# EAGLE design Ethernet Phy 4 esp32 (EAGLE 9.1.3)
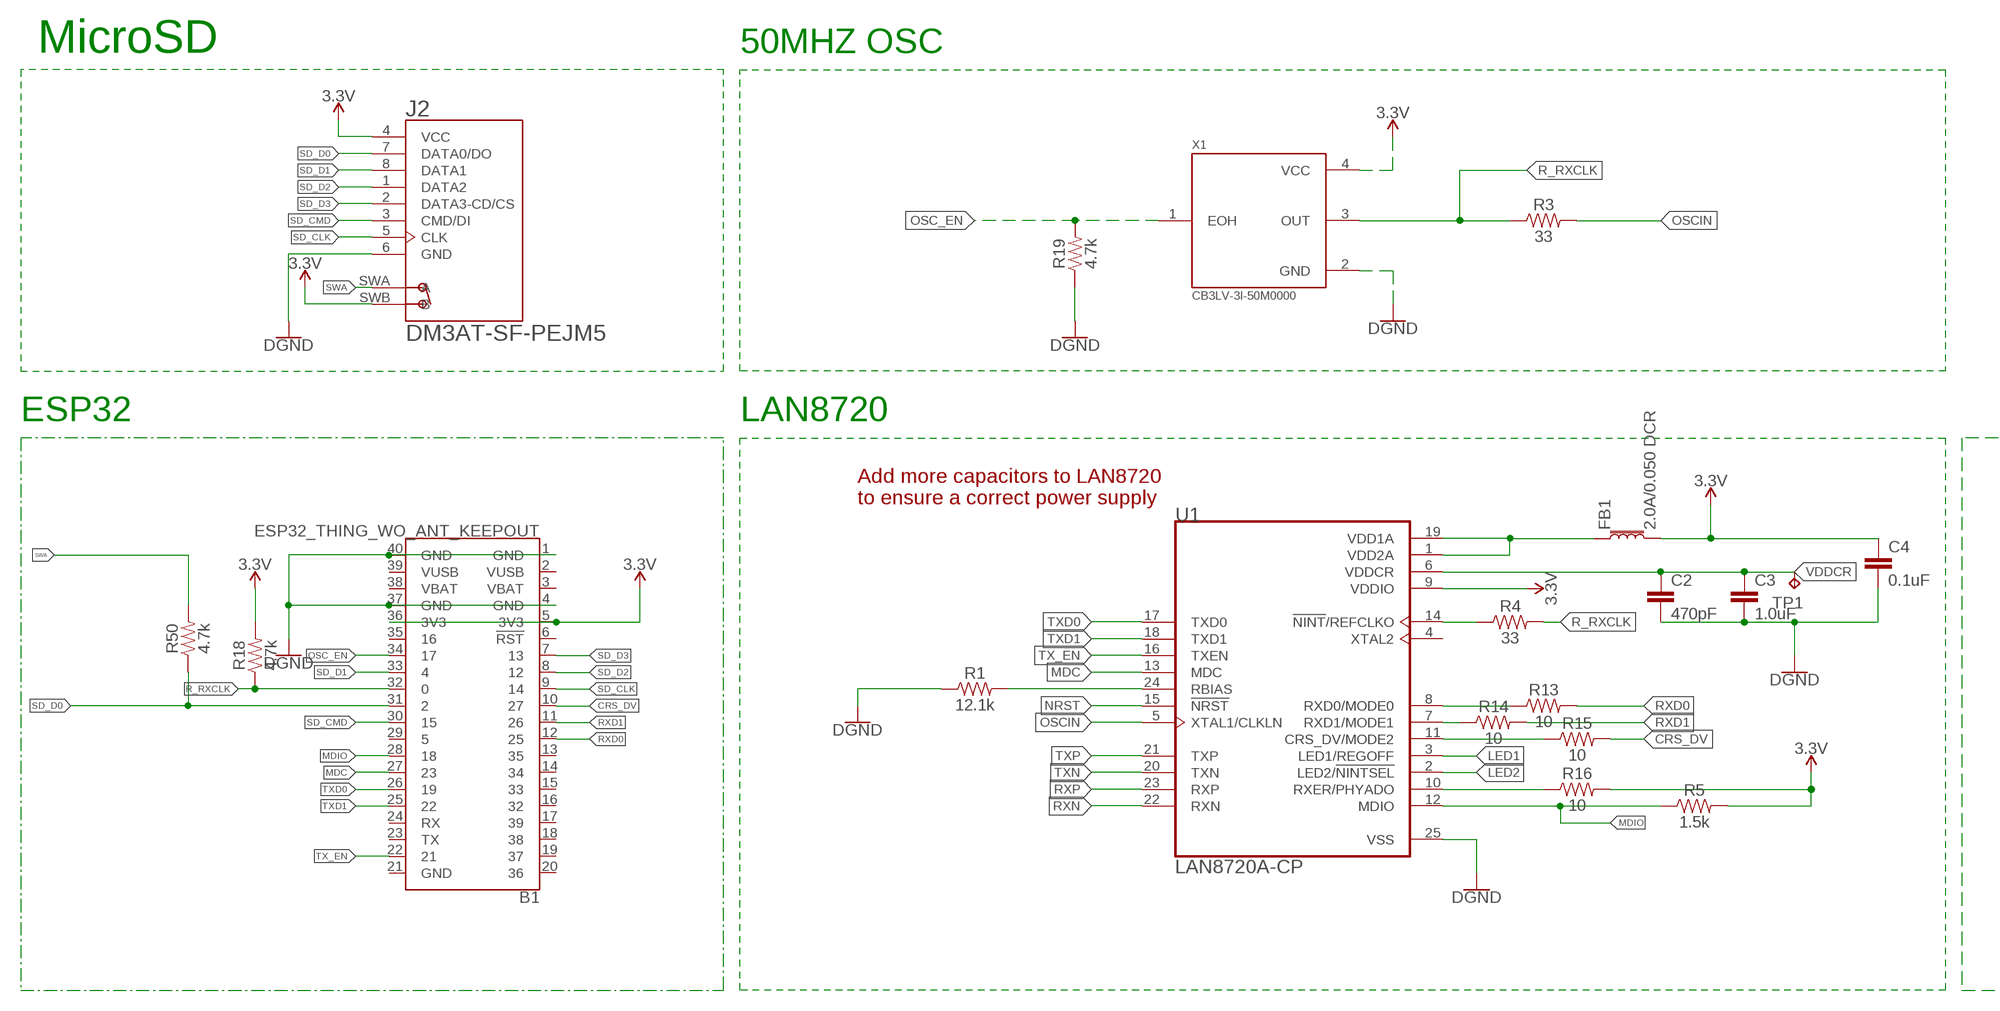
[diagram p0: schematic, sheet 1, part 1 of 2]
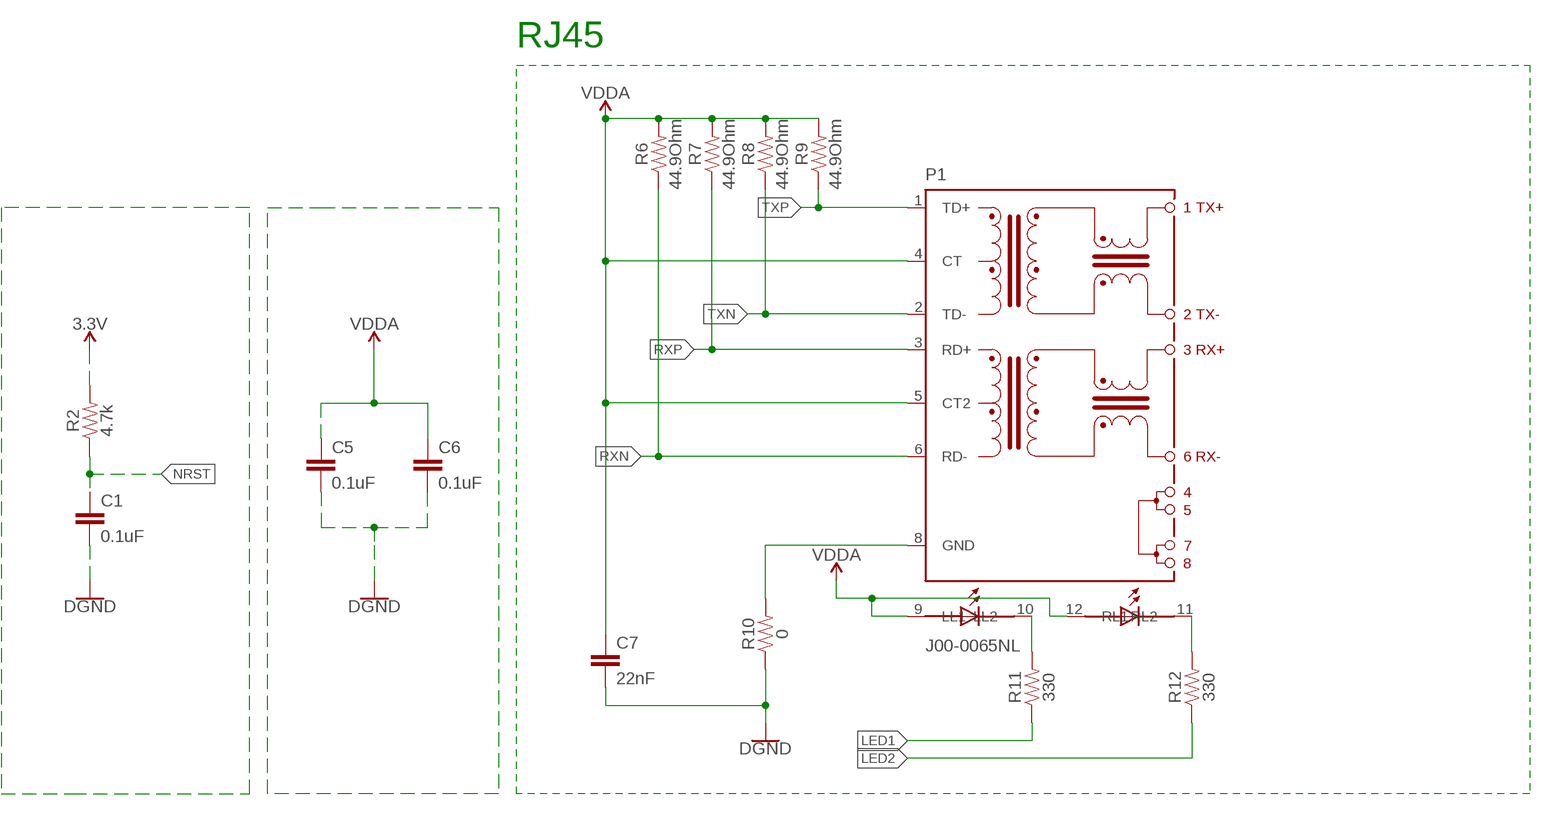
[diagram p1: schematic, sheet 1, part 2 of 2]

## Parts
B1  ESP32_THING_WO_ANT_KEEPOUT  [ESP32_THING_NO_ANT]
C1  0.1uF  0.1UF-0603-100V-10%  [0603]
C2  470pF  470PF-0603-50V-5%  [0603]
C3  1.0uF  1.0UF-0603-16V-10%  [0603]
C4  0.1uF  0.1UF-0603-100V-10%  [0603]
C5  0.1uF  0.1UF-0603-25V-(+80/-20%)  [0603]
C6  0.1uF  0.1UF-0603-25V-(+80/-20%)  [0603]
C7  22nF  22NF/22,000PF-0603-50V-10%  [0603]
FB1  2.0A/0.050 DCR  FERRITE_BEAD-0603  [0603]
J2  DM3AT-SF-PEJM5  [HRS_DM3AT-SF-PEJM5]
P1  J00-0065NL  [PULSE_J00-0065NL]
R1  12.1k  12.1KOHM-0603-1/10W-1%  [0603]
R2  4.7k  4.7KOHM-0603-1/10W-1%  [0603]
R3  33  33OHM-0603-1/10W-1%  [0603]
R4  33  33OHM-0603-1/10W-1%  [0603]
R5  1.5k  1.5KOHM-0603-1/10W-1%  [0603]
R6  44.9Ohm  43KOHM-0603-1/10W-1%  [0603]
R7  44.9Ohm  43KOHM-0603-1/10W-1%  [0603]
R8  44.9Ohm  43KOHM-0603-1/10W-1%  [0603]
R9  44.9Ohm  43KOHM-0603-1/10W-1%  [0603]
R10  0  0OHM-0603-1/10W-5%  [0603]
R11  330  330OHM-0603-1/10W-1%  [0603]
R12  330  330OHM-0603-1/10W-1%  [0603]
R13  10  10OHM-0603-1/10W-1%  [0603]
R14  10  10OHM-0603-1/10W-1%  [0603]
R15  10  10OHM-0603-1/10W-1%  [0603]
R16  10  10OHM-0603-1/10W-1%  [0603]
R18  4.7k  4.7KOHM-0603-1/10W-1%  [0603]
R19  4.7k  4.7KOHM-0603-1/10W-1%  [0603]
R50  4.7k  4.7KOHM-0603-1/10W-1%  [0603]
TP1  TPB1,27  [B1,27]
U1  LAN8720A-CP  [QFN50P400X400X100-25N]
X1  CB3LV-3I-50M0000  [OSCCC700X500X180-4N]

## Nets
3.3V: B1.5(3V3) B1.36(3V3) C4.1 FB1.2 J2.4(VCC) J2.SWB(B) R2.2 R5.2 R16.2 R18.2 U1.9(VDDIO) X1.4(VCC)
CRS_DV: B1.10 R15.2
GND: B1.1(GND) B1.4(GND) B1.37(GND) B1.40(GND) C1.2 C2.2 C3.2 C4.2 C5.2 C6.2 C7.2 J2.6(GND) R1.1 R10.1 R19.1 U1.25(VSS) X1.2(GND) ; supply symbol labelled DGND
LED1: R11.1 U1.3(LED1/REGOFF)
LED2: R12.1 U1.2(LED2/!NINTSEL!)
MDC: B1.27 U1.13(MDC)
MDIO: B1.28 R5.1 U1.12(MDIO)
N$4: R1.2 U1.24(RBIAS)
N$7: R4.1 U1.14(!NINT!/REFCLKO)
N$8: FB1.1 U1.1(VDD2A) U1.19(VDD1A)
N$10: P1.10(LL2) R11.2
N$12: P1.8(GND) R10.2
N$13: P1.11(RL2) R12.2
N$14: R14.1 U1.7(RXD1/MODE1)
N$15: R13.1 U1.8(RXD0/MODE0)
N$16: R15.1 U1.11(CRS_DV/MODE2)
N$17: R16.1 U1.10(RXER/PHYADO)
NRST: C1.1 R2.1 U1.15(!NRST)
OSC_EN: B1.34 R19.2 X1.1(EOH)
OSCIN: R3.2 U1.5(XTAL1/CLKLN)
R_RXCLK: B1.32 R3.1 R4.2 R18.1 X1.3(OUT)
RXD0: B1.12 R13.2
RXD1: B1.11 R14.2
RXN: P1.6(RD-) R6.1 U1.22(RXN)
RXP: P1.3(RD+) R7.1 U1.23(RXP)
SD_CLK: B1.9 J2.5(CLK)
SD_CMD: B1.30 J2.3(CMD/DI)
SD_D0: B1.31 J2.7(DATA0/DO) R50.1
SD_D1: B1.33 J2.8(DATA1)
SD_D2: B1.8 J2.1(DATA2)
SD_D3: B1.7 J2.2(DATA3-CD/CS)
SWA: J2.SWA(A) R50.2
TX_EN: B1.22 U1.16(TXEN)
TXD0: B1.26 U1.17(TXD0)
TXD1: B1.25 U1.18(TXD1)
TXN: P1.2(TD-) R8.1 U1.20(TXN)
TXP: P1.1(TD+) R9.1 U1.21(TXP)
VDDA: C5.1 C6.1 C7.1 P1.4(CT) P1.5(CT2) P1.9(LL1) P1.12(RL1) R6.2 R7.2 R8.2 R9.2
VDDCR: C2.1 C3.1 TP1.TP U1.6(VDDCR)
Unconnected: B1.2(VUSB) B1.3(VBAT) B1.6(!RST!) B1.13 B1.14 B1.15 B1.16 B1.17 B1.18 B1.19 B1.20 B1.21(GND) B1.23(TX) B1.24(RX) B1.29 B1.35 B1.38(VBAT) B1.39(VUSB) U1.4(XTAL2)

## Notes on the sheet
- MicroSD | 50MHZ OSC
- RJ45
- ESP32 | LAN8720
- Add more capacitors to LAN8720
  to ensure a correct power supply

## Library data of the parts
B1 = SparkFun-Boards:ESP32_THING: SparkFun ESP32 Thing Board Pins, silkscreen, and logos matching the layout of the SparkFun ESP32 Thing <https://www.sparkfun.com/products/13907> Dimensions: 2.32" x 1.00"
C1 C4 = SparkFun-Capacitors:0.1UF: 0.1µF ceramic capacitors A capacitor is a passive two-terminal electrical component used to store electrical energy temporarily in an electric field.; PROD_ID: CAP-08390
C2 = SparkFun-Capacitors:470PF: 470pF ceramic capacitors A capacitor is a passive two-terminal electrical component used to store electrical energy temporarily in an electric field.; PROD_ID: CAP-07884
C3 = SparkFun-Capacitors:1.0UF: 1µF ceramic capacitors A capacitor is a passive two-terminal electrical component used to store electrical energy temporarily in an electric field.; PROD_ID: CAP-00868
C5 C6 = SparkFun-Capacitors:0.1UF: 0.1µF ceramic capacitors A capacitor is a passive two-terminal electrical component used to store electrical energy temporarily in an electric field.; PROD_ID: CAP-00810
C7 = SparkFun-Capacitors:22NF/22,000PF: 0.022uF/22nF/22,000pF ceramic capacitors A capacitor is a passive two-terminal electrical component used to store electrical energy temporarily in an electric field.; PROD_ID: CAP-07885
FB1 = SparkFun-Coils:FERRITE_BEAD: Ferrite Bead (blocks, cores, rings, chokes, etc.) Inductor with layers of ferrite used to suppress high frequencies. Often used to isolate high frequency noise. SparkFun Products: IOIO-OTG - V2.2 <https://www.sparkfun.com/products/13613> SparkFun SAMD21 Mini Breakout <https://www.sparkfun.com/products/13664> SparkFun 6 Degrees of Freedom Breakout - LSM6DS3 <https://www.sparkfun.com/products/13339> SparkFun SAMD21 Dev Breakout <https://www.sparkfun.com/products/13672>; PROD_ID: NDUC-07859; VALUE: 30Ω/1.8A
J2 = DM3AT-SF-PEJM5:DM3AT-SF-PEJM5: DM3 Series 8 Position Right Angle SMT Push Push Ejection MicroSD Card Connector; AVAILABILITY: Good; DESCRIPTION: DM3 Series 8 Position Right Angle SMT Push Push Ejection MicroSD Card Connector; MF: Hirose; MP: DM3AT-SF-PEJM5; PACKAGE: None; PRICE: 1.92 USD
P1 = J00-0065NL:J00-0065NL: Conn RJ-45 Integrated Magnetics F 8 POS 2.54mm Solder RA Thru-Hole 12 Terminal 1 Port Cat 5/Cat 6; AVAILABILITY: Good; DESCRIPTION: Conn RJ-45 Integrated Magnetics F 8 POS 2.54mm Solder RA Thru-Hole 12 Terminal 1 Port Cat 5/Cat 6; MF: Pulse Electronics; MP: J00-0065NL; PACKAGE: FakePackage u; PRICE: 4.28 USD
R1 = SparkFun-Resistors:12.1KOHM: 12.1kΩ resistor A resistor is a passive two-terminal electrical component that implements electrical resistance as a circuit element. Resistors act to reduce current flow, and, at the same time, act to lower voltage levels within circuits. - Wikipedia; PROD_ID: RES-09378
R2 R18 R19 R50 = SparkFun-Resistors:4.7KOHM: 4.7kΩ resistor A resistor is a passive two-terminal electrical component that implements electrical resistance as a circuit element. Resistors act to reduce current flow, and, at the same time, act to lower voltage levels within circuits. - Wikipedia; PROD_ID: RES-07857
R3 R4 = SparkFun-Resistors:33OHM: 33Ω resistor A resistor is a passive two-terminal electrical component that implements electrical resistance as a circuit element. Resistors act to reduce current flow, and, at the same time, act to lower voltage levels within circuits. - Wikipedia; PROD_ID: RES-08270
R5 = SparkFun-Resistors:1.5KOHM: 1.5kΩ resistor A resistor is a passive two-terminal electrical component that implements electrical resistance as a circuit element. Resistors act to reduce current flow, and, at the same time, act to lower voltage levels within circuits. - Wikipedia; PROD_ID: RES-08306
R6-R9 = SparkFun-Resistors:43KOHM: 43kΩ resistor A resistor is a passive two-terminal electrical component that implements electrical resistance as a circuit element. Resistors act to reduce current flow, and, at the same time, act to lower voltage levels within circuits. - Wikipedia; PROD_ID: RES-07858; VALUE: 43k
R10 = SparkFun-Resistors:0OHM: 0Ω resistor A resistor is a passive two-terminal electrical component that implements electrical resistance as a circuit element. Resistors act to reduce current flow, and, at the same time, act to lower voltage levels within circuits. - Wikipedia; PROD_ID: RES-08609
R11 R12 = SparkFun-Resistors:330OHM: 330Ω resistor A resistor is a passive two-terminal electrical component that implements electrical resistance as a circuit element. Resistors act to reduce current flow, and, at the same time, act to lower voltage levels within circuits. - Wikipedia; PROD_ID: RES-00818
R13-R16 = SparkFun-Resistors:10OHM: 10Ω resistor A resistor is a passive two-terminal electrical component that implements electrical resistance as a circuit element. Resistors act to reduce current flow, and, at the same time, act to lower voltage levels within circuits. - Wikipedia; PROD_ID: RES-12581
TP1 = testpad:TP: Test pad
U1 = LAN8720A-CP:LAN8720A-CP: LAN8720A Series 3.3 V RMII 10/100 Ethernet Transceiver Surface Mount - QFN-24; AVAILABILITY: Good; DESCRIPTION: LAN8720A Series 3.3 V RMII 10/100 Ethernet Transceiver Surface Mount - QFN-24; MF: Microchip; MP: LAN8720A-CP; PACKAGE: QFN-24 Microchip; PRICE: 1.22 USD
X1 = CB3LV-3I-50M0000:CB3LV-3I-50M0000: Oscillator XO 50MHz 50ppm 50pF HCMOS/TTL 55% 3.3V 4-Pin SMD T/R; AVAILABILITY: Good; DESCRIPTION: CB3LV Series 50 MHz 7 x 5 mm 3.3 V ±50 ppm SMT HCMOS/TTL Clock Oscillator; MF: CTS-Frequency; MP: CB3LV-3I-50M0000; PACKAGE: SMD-4 CTS Components; PRICE: 1.14 USD

## Board
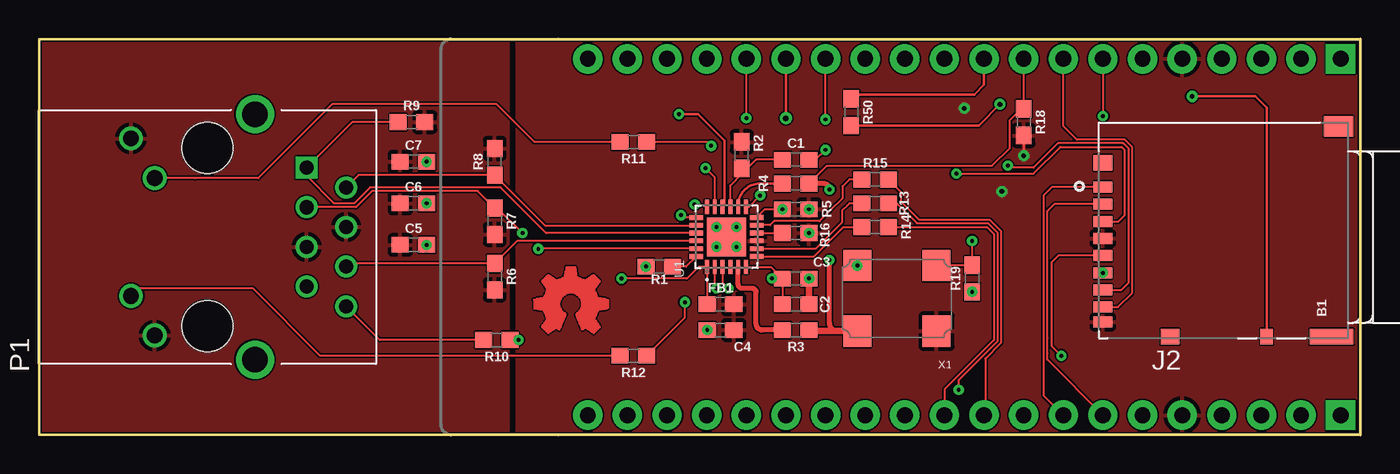
[diagram p2: board, top side]
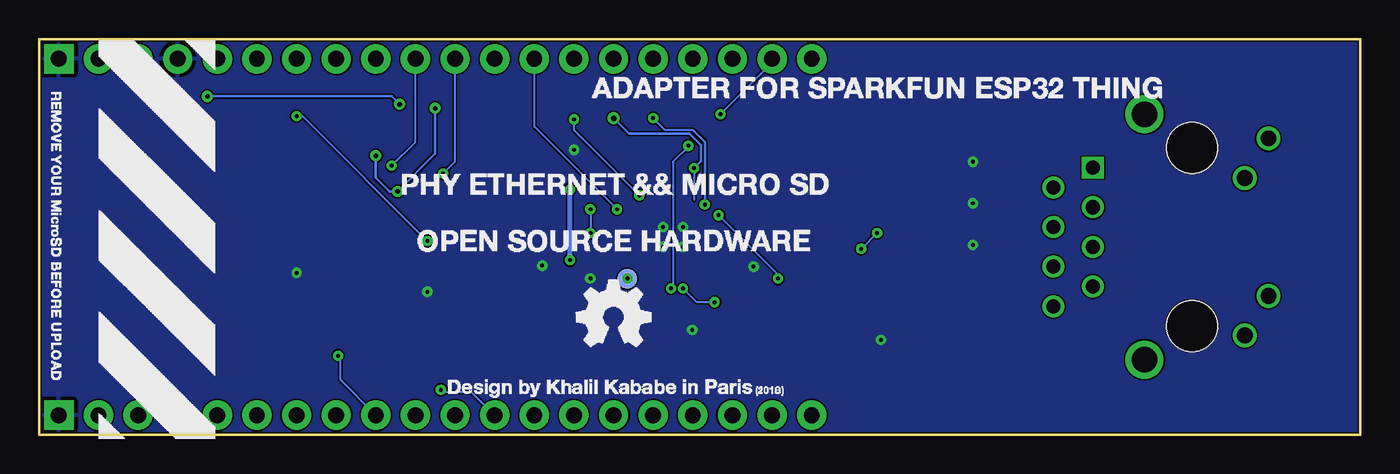
[diagram p3: board, bottom side, seen from below]

Size 84.71 x 25.4 mm. Coordinates in mm from the lower left corner, seen from the top.
Outline: 84.71,0 84.71,25.4 0,25.4 0,0 84.71,0
Copper layers (1*16): Top 0.035mm / dielectric 1.5mm / Bottom 0.035mm
Design rules "default *": minimum track width 0.1mm, minimum drill 0.25mm, track to track 0.1mm, track to pad 0.1mm, pad to pad 0.1mm, via to via 0.1mm, smd to smd 0mil, copper to edge 0.1mm, drill to drill 0.1mm, minimum pad ring 10mil, minimum via ring 8mil, stop-mask expansion 4mil, vias tented up to drill 0mil, thermal gap 10mil

### Footprints (pad centres in the part's own frame; a part is rotated, then mirrored left to right if it is on the bottom)
ESP32_THING_NO_ANT = drill 1.016 pad 1.88 square: 1 1.27,1.27; 40 24.13,1.27 | drill 1.016 pad 1.88: 2 1.27,3.81; 3 1.27,6.35; 4 1.27,8.89; 5 1.27,11.43; 6 1.27,13.97; 7 1.27,16.51; 8 1.27,19.05; 9 1.27,21.59; 10 1.27,24.13; 11 1.27,26.67; 12 1.27,29.21; 13 1.27,31.75; 14 1.27,34.29; 15 1.27,36.83; 16 1.27,39.37; 17 1.27,41.91; 18 1.27,44.45; 19 1.27,46.99; 20 1.27,49.53; 21 24.13,49.53; 22 24.13,46.99; 23 24.13,44.45; 24 24.13,41.91; 25 24.13,39.37; 26 24.13,36.83; 27 24.13,34.29; 28 24.13,31.75; 29 24.13,29.21; 30 24.13,26.67; 31 24.13,24.13; 32 24.13,21.59; 33 24.13,19.05; 34 24.13,16.51; 35 24.13,13.97; 36 24.13,11.43; 37 24.13,8.89; 38 24.13,6.35; 39 24.13,3.81
0603 = smd 1.1 x 1: 1 -0.85,0; 2 0.85,0
HRS_DM3AT-SF-PEJM5 = smd 0.7 x 1.2: 1 3.2,0; 2 2.1,0; 3 1,0; 4 -0.1,0; 5 -1.2,0; 6 -2.3,0; 7 -3.4,0; 8 -4.5,0; SWB -5.45,0 | smd 1 x 1.2: P1 -6.4,-4.3; P4 4.75,0 | smd 1 x 2.8: P2 -6.4,-14.65 | smd 1.3 x 1.9: P3 7.1,-15.1 | smd 1 x 0.8: SWA -6.4,-10.5
PULSE_J00-0065NL = drill 0.9 square: 1 4.445,-6.35 | drill 0.9: 2 3.175,-8.889; 3 1.905,-6.35; 4 0.635,-8.889; 5 -0.635,-6.35; 6 -1.905,-8.889; 7 -3.175,-6.35; 8 -4.445,-8.889 | drill 1.02: 9 6.325,4.9; 10 3.785,3.38; 11 -3.785,4.9; 12 -6.325,3.38 | drill 1.63: S1 7.875,-3.05; S2 -7.875,-3.05 | hole 3.25: -5.715,0; 5.715,0
B1,27 = smd 1.27 x 1.27: TP 0,0
QFN50P400X400X100-25N = smd 0.86 x 0.26: 1 -1.935,1.25; 2 -1.935,0.75; 3 -1.935,0.25; 4 -1.935,-0.25; 5 -1.935,-0.75; 6 -1.935,-1.25; 13 1.935,-1.25; 14 1.935,-0.75; 15 1.935,-0.25; 16 1.935,0.25; 17 1.935,0.75; 18 1.935,1.25 | smd 0.26 x 0.86: 7 -1.25,-1.935; 8 -0.75,-1.935; 9 -0.25,-1.935; 10 0.25,-1.935; 11 0.75,-1.935; 12 1.25,-1.935; 19 1.25,1.935; 20 0.75,1.935; 21 0.25,1.935; 22 -0.25,1.935; 23 -0.75,1.935; 24 -1.25,1.935 | smd 2.5 x 2.5: 25 0,0
OSCCC700X500X180-4N = smd 1.8 x 2: 1 -2.54,-2.1; 2 2.54,-2.1; 3 2.54,2.1; 4 -2.54,2.1

### Placement (x,y rotation side)
B1  84.71,0 90 top
C1  48.51,17.65 0 top
C2  48.51,8.38 0 top
C3  48.51,10.03 0 top
C4  43.69,6.73 180 top
C5  24,12.19 0 top
C6  24,14.86 0 top
C7  24,17.53 0 top
FB1  43.69,8.38 0 top
J2  68.2,12.7 90 top
P1  10.8,12.7 90 top
R1  39.75,10.79 0 top
R2  45.04,17.95 90 top
R3  48.51,6.73 180 top
R4  48.51,16.13 0 top
R5  48.51,14.48 0 top
R6  29.21,10.16 270 top
R7  29.21,13.72 270 top
R8  29.21,17.53 90 top
R9  23.88,20.07 0 top
R10  29.34,6.1 180 top
R11  38.1,18.8 180 top
R12  38.1,5.08 180 top
R13  53.59,14.86 0 top
R14  53.59,13.33 0 top
R15  53.59,16.38 0 top
R16  48.51,12.95 0 top
R18  63.12,20.07 270 top
R19  59.82,10.03 90 top
R50  52.07,20.7 270 top
TP1  46.99,10.03 180 bottom
U1  44.07,12.7 90 top
X1  54.99,8.76 180 top

### Tracks (layer width: path | path; a pad name or v marks a point on that pad's centre or on a via)
3.3V  (via drill 0.25, 0.3)
  Top 0.152: 59.31,20.89 v59.31,20.96 | R18.2 v63.12,17.91
  Bottom 0.127: R5.2 R16.2
  Bottom 0.152: v59.31,20.96 59.31,18.03 v61.72,15.62 62.23,15.62 63.12,16.51 v63.12,17.91
  other vias: 49.36,14.48 49.36,12.95
  pour Top: 85.84,-0.52 30.61,-0.52 30.61,26.53 30.61,31.04 58.79,31.04 85.84,31.04
CRS_DV
  Top 0.127: R15.2 55.24,15.58 55.24,14.99 56.41,13.82 60.93,13.82 61.67,13.08 61.67,5.91 60.65,4.89 60.65,1.34 B1.10
GND  (via drill 0.25)
  Top 0.127: R10.1 v30.73,6.1 | C1.2 49.78,17.65 v50.42,18.29 | U1.25 v43.43,12.07
  Top 0.406: C3.2 C2.2 | C3.2 | U1.25 v44.7,12.07 | U1.25 v44.7,13.34 | U1.25 43.94,12.7 v43.43,13.34
  other vias: 52.45,10.86 49.36,10.03 42.84,6.73 38.9,10.79 59.82,9.18 68.2,10.4 24.85,12.19 24.85,14.86 24.85,17.53
  pour Bottom: 86.96,-0.52 30.61,-0.52 30.61,31.04 30.61,32.16 86.96,32.16
  pour Bottom: 30.86,-0.25 0,-0.25 0,25.78 30.86,25.78
LED1  (via drill 0.25)
  Top 0.127: v43.09,18.55 42.84,18.8 R11.1 | U1.3 43.82,9.78 v44.2,9.4
  Bottom 0.127: v44.2,9.4 44.07,9.53 44.07,17.53 43.09,18.51 v43.09,18.55
LED2  (via drill 0.25)
  Top 0.127: R12.1 41.4,7.53 v41.4,8.51 | v43.43,9.4 43.32,9.51 U1.2
  Bottom 0.127: v41.4,8.51 42.54,8.51 v43.43,9.4
MDC  (via drill 0.25)
  Top 0.127: U1.13 45.5,14.64 v46.23,15.37 | v50.41,20.24 B1.27
  Bottom 0.127: v46.23,15.37 50.42,19.56 v50.41,20.24
MDIO  (via drill 0.25)
  Top 0.125: U1.12 46.53,14.48 R5.1
  Bottom 0.127: R5.1 52.96,19.77 B1.28
  other vias: 47.66,14.48
N$4
  Top 0.125: U1.24 41.48,10.8 R1.2
N$7
  Top 0.125: 44.82,14.73 44.82,15.1
  Top 0.127: R4.1 47.5,16.13 | 44.82,14.73 U1.14 44.82,15.1
  Top 0.15: R4.1 47.5,16.13 46.22,16.13 arc90 44.82,14.73
N$8  (via drill 0.25)
  Top 0.127: FB1.1 42.82,8.4 42.82,8.51 42.82,10.41 U1.1 42.26,10.77 41.53,10.03 v37.34,10.03 | U1.19 41.29,13.95 v41.15,14.1
  Bottom 0.127: v41.15,14.1 37.34,10.29 v37.34,10.03
N$10
  Top 0.127: R11.2 31.75,18.8 29.34,21.21 18.8,21.21 14.06,16.48 9.99,16.48 9.98,16.49 P1.10
N$12
  Top 0.125: R10.2 21.84,6.1 P1.8
N$13
  Top 0.127: R12.2 18.03,5.08 13.72,9.4 6.38,9.4 P1.11
N$14
  Top 0.125: U1.7 49.68,11.45 51.56,13.34 R14.1
N$15
  Top 0.125: U1.8 49.8,11.95 50.16,12.32 | 51.82,14.73 51.5,14.41
  Top 0.127: 50.16,12.32 51.5,13.65 51.5,14.41 | R13.1 51.94,14.86 51.82,14.73
N$16
  Top 0.125: U1.11 46.02,13.46 46.86,13.46 47.12,13.72 50.04,13.72 50.67,14.35 | R15.1 51.94,16.38 51.5,15.94
  Top 0.127: 50.67,14.35 51.5,15.18 51.5,15.94
N$17
  Top 0.125: U1.10 R16.1
NRST
  Top 0.125: U1.15 44.32,16 45.04,16.72 | 45.04,16.72 R2.1 | C1.1 45.97,17.65 45.04,16.72
OSC_EN  (via drill 0.25)
  Top 0.127: X1.1 57.55,10.88 R19.2 v59.82,12.45 | v59.82,12.45 | B1.34 v68.2,20.45
  Bottom 0.127: v59.82,12.45 67.82,20.45 v68.2,20.45
OSCIN
  Top 0.305: R3.2 46.35,6.73 arc-90 45.97,7.11 45.97,9.14 arc90 45.72,9.4 45.08,9.4 arc-90 44.82,9.66 U1.5
R_RXCLK  (via drill 0.25)
  Top 0.127: R18.1 63.12,20.96 | 63.12,20.96 B1.32 | R4.2 50.51,17.27 61.09,17.27 62.23,18.42 62.23,20.19 62.99,20.96 63.12,20.96
  Top 0.305: 51.18,6.66 arc-90 50.67,7.17 v50.67,11.22 | v50.67,15.75 arc90 50.29,16.13 R4.2
  Top 0.406: X1.3 51.18,6.66 49.43,6.66 R3.1
  Bottom 0.305: v50.67,11.22 v50.67,15.75
RXD0  (via drill 0.25)
  Top 0.127: R13.2 54.99,14.86 56.26,13.59 60.83,13.59 61.44,12.98 61.44,6 58.95,3.51 v58.95,2.9
  Bottom 0.127: B1.12 57,2.77 58.82,2.77 v58.95,2.9
RXD1
  Top 0.127: B1.11 58.04,2.92 61.21,6.1 61.21,12.89 60.77,13.34 R14.2
RXN
  Top 0.125: P1.6 19.9,11.01 R6.1 30.65,12.45 U1.22
RXP  (via drill 0.25)
  Top 0.125: P1.3 20.32,14.61 21.36,15.65 28.13,15.65 R7.1 29.38,14.57 v30.99,12.95 | U1.23 32.02,11.95 v32,11.94
  Bottom 0.125: v32,11.94 v30.99,12.95
SD_CLK  (via drill 0.25)
  Top 0.127: J2.5 65.35,11.5 64.9,11.05 64.9,5.72 v65.53,5.08
  Bottom 0.127: B1.9 65.4,3.56 65.4,4.95 v65.53,5.08
SD_CMD  (via drill 0.25)
  Top 0.127: J2.3 69.2,13.7 69.6,14.1 69.6,18.29 69.41,18.48 65.47,18.48 63.75,16.76 v58.8,16.76
  Bottom 0.127: v58.8,16.76 58.04,17.53 B1.30
SD_D0  (via drill 0.25)
  Top 0.127: J2.7 69.37,9.3 69.85,9.78 69.85,18.36 69.5,18.71 65.31,18.71 63.75,17.15 62.23,17.15 v62.1,17.27
  Top 0.152: R50.1 52.36,21.84 59.94,21.84 60.58,22.48 B1.31
  Bottom 0.127: v62.1,17.27 60.58,18.8 B1.31
SD_D1
  Top 0.127: J2.8 69.16,8.2 70.08,9.12 70.08,18.45 69.59,18.93 66.54,18.93 65.66,19.81 B1.33
SD_D2
  Top 0.127: B1.8 64.39,2.54 64.39,15.37 64.92,15.9 J2.1
SD_D3
  Top 0.127: J2.2 65.09,14.8 64.64,14.35 64.64,6.22 64.64,5.25 64.64,5.24 64.64,4.83 B1.7
SWA  (via drill 0.3)
  Top 0.152: J2.SWA 78.7,21 77.98,21.72 v73.91,21.72 | R50.2 60.24,19.85 v61.59,21.21
  Bottom 0.152: v73.91,21.72 62.1,21.72 v61.59,21.21
TX_EN  (via drill 0.25)
  Top 0.15: U1.16 43.95,14.76 43.95,18.88 42.25,20.57 v41.02,20.57
  Bottom 0.127: v41.02,20.57 37.72,23.88 B1.22
TXD0  (via drill 0.25, 0.35)
  Top 0.125: U1.17 43.32,16.51 v42.72,17.11
  Top 0.15: v47.87,20.32 v47.88,20.33 B1.26
  Bottom 0.125: v42.72,17.11 42.72,15.08
  Bottom 0.15: v42.72,17.11 42.28,17.55 42.28,18.58 43.02,19.32 46.87,19.32 v47.87,20.32
TXD1  (via drill 0.25)
  Top 0.125: U1.18 42.23,14.78 v42.03,14.78
  Top 0.127: v45.34,20.32 B1.25
  Bottom 0.125: 42.03,14.81 v42.03,14.78
  Bottom 0.127: 42.73,19.49 42.8,19.56 44.58,19.56 v45.34,20.32
  Bottom 0.15: 42.73,19.49 42.03,18.79 42.03,14.81
TXN
  Top 0.125: U1.20 32.44,13.45 R8.1 20.48,16.68 P1.2
TXP
  Top 0.125: U1.21 32.52,12.95 29.59,15.88 21.21,15.88 20.19,14.86 18.92,14.86 17.14,16.64 P1.1 20.07,20.07 R9.1
VDDA
  pour Top: -2.07,-0.52 -2.07,26.53 5.82,26.53 29.49,26.53 30.1,26.53 30.1,-0.49 3.3,-0.49 3.3,-0.52 -0.88,-0.52
VDDCR  (via drill 0.25)
  Top 0.125: C3.1 TP1.TP | U1.6 46.93,10.77 C3.1 | C3.1 C2.1
  other vias: 46.99,10.03
(copper drawn outside any net)
  shapes: Top area x185